# Altium schematic sheet Bluetooth-MX8M.SchDoc
size B; SheetNumber: 10; SheetTotal: 15
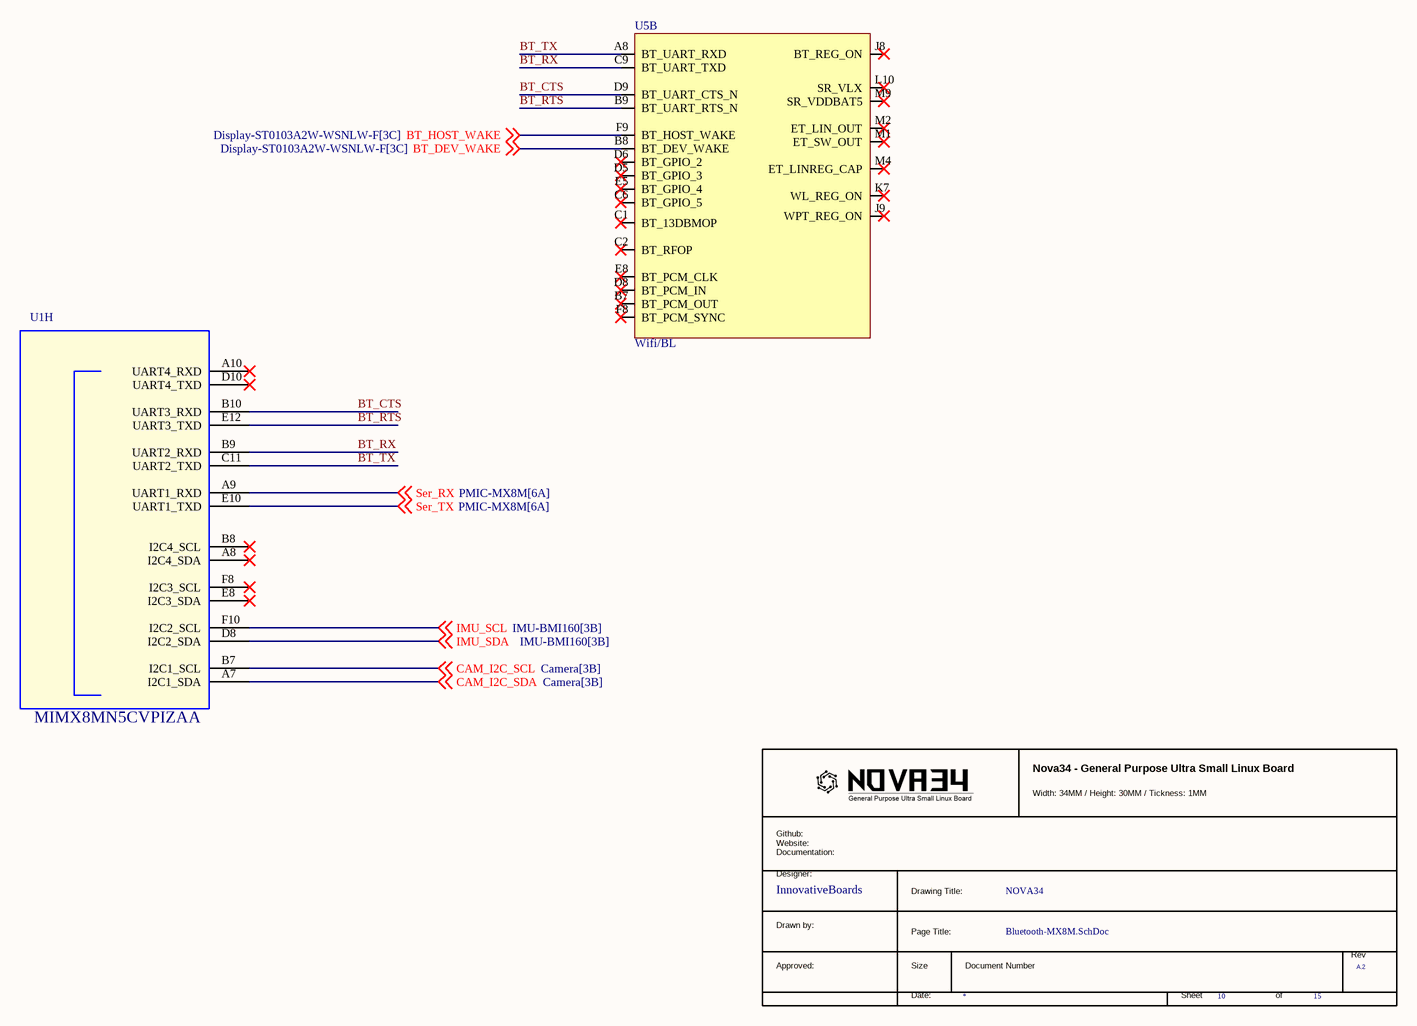
[diagram p0: Bluetooth-MX8M.SchDoc]

## Parts
*  RevCode: A.2  (hidden comment: TitleBlock_MCPG)  (graphical)
U1  MIMX8MN5CVPIZAA  [BGA306C50P21X21_1100X1100X101]  (part H of 12)
U5  Wifi/BL  [106 BALL WLBGA 3.76X4.43X0.53 MM]  (part B of 3)

## Nets
BT_CTS: U1.B10(UART3_RXD) U5.D9(BT_UART_CTS_N)
BT_DEV_WAKE: U5.B8(BT_DEV_WAKE) ; off-sheet BT_DEV_WAKE
BT_HOST_WAKE: U5.F9(BT_HOST_WAKE) ; off-sheet BT_HOST_WAKE
BT_RTS: U1.E12(UART3_TXD) U5.B9(BT_UART_RTS_N)
BT_RX: U1.B9(UART2_RXD) U5.C9(BT_UART_TXD)
BT_TX: U1.C11(UART2_TXD) U5.A8(BT_UART_RXD)
CAM_I2C_SCL: U1.B7(I2C1_SCL) ; off-sheet CAM_I2C_SCL
CAM_I2C_SDA: U1.A7(I2C1_SDA) ; off-sheet CAM_I2C_SDA
IMU_SCL: U1.F10(I2C2_SCL) ; off-sheet IMU_SCL
IMU_SDA: U1.D8(I2C2_SDA) ; off-sheet IMU_SDA
Ser_RX: U1.A9(UART1_RXD) ; off-sheet Ser_RX
Ser_TX: U1.E10(UART1_TXD) ; off-sheet Ser_TX

Not connected (* = marked no-connect by the designer): U1 A8(I2C4_SDA)* A10(UART4_RXD)* B8(I2C4_SCL)* D10(UART4_TXD)* E8(I2C3_SDA)* F8(I2C3_SCL)*; U5 B7(BT_PCM_OUT)* C1(BT_13DBMOP)* C2(BT_RFOP)* C6(BT_GPIO_5)* D5(BT_GPIO_3)* D6(BT_GPIO_2)* D8(BT_PCM_IN)* E5(BT_GPIO_4)* E8(BT_PCM_CLK)* F8(BT_PCM_SYNC)* J8(BT_REG_ON)* J9(WPT_REG_ON)* K7(WL_REG_ON)* L10(SR_VLX)* M1(ET_SW_OUT)* M2(ET_LIN_OUT)* M4(ET_LINREG_CAP)* M9(SR_VDDBAT5)*

## Notes on the sheet
- (in symbol TitleBlock_MCPG) Nova34 - General Purpose Ultra Small Linux Board; Width: 34MM / Height: 30MM / Tickness: 1MM; Github: / Website: / Documentation:; Designer:; InnovativeBoards; Drawing Title:; NOVA34; Drawn by:; Page Title:; Rev; Approved:; Size; Document Number; Date:; Sheet; of

## Library data of the parts
U1 = MIMX8MN: IC CPU QUAD CORTEX A53+M7 1.4GHZ -- BGA306; PCB Footprint: pbga306_0p5_sq11mm; AGILE_PN: TMP-CIP-5098; CAD_APPROVED: Yes; PRE_APN: 330-77152; Temp Range: -40¡ãC to 105¡ãC; MFG_NAME01: NXP SEMICONDUCTORS; CLASS: IC; HEIGHT: 1.01MM; ROHS: Yes; MFG_PN01: MIMX8MN5CVPIZAA
U5 = CYW43012
* = TitleBlock_MCPG: Page Create Date: March  8, 1995